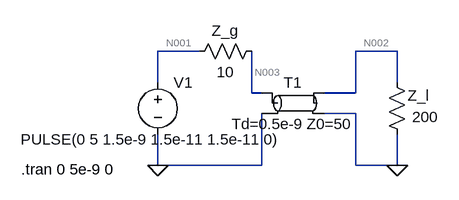
[diagram p0: schematic Problem 5.asc]
Problem 5.asc, the LTspice schematic file:
Version 4
SHEET 1 964 680
WIRE 128 -32 64 -32
WIRE 432 -32 368 -32
WIRE 64 16 64 -32
WIRE 432 16 432 -32
WIRE 208 32 208 -32
WIRE 224 32 208 32
WIRE 368 32 368 -32
WIRE 368 32 320 32
WIRE 368 64 320 64
WIRE 64 144 64 96
WIRE 224 144 224 64
WIRE 224 144 64 144
WIRE 368 144 368 64
WIRE 432 144 432 96
WIRE 432 144 368 144
FLAG 64 144 0
FLAG 432 144 0
SYMBOL voltage 64 0 R0
WINDOW 3 -211 104 Left 2
WINDOW 123 0 0 Left 0
WINDOW 39 0 0 Left 0
SYMATTR InstName V1
SYMATTR Value PULSE(0 5 1.5e-9 1.5e-11 1.5e-11 0)
SYMBOL res 416 0 R0
WINDOW 0 32 36 Left 2
WINDOW 3 39 69 Left 2
SYMATTR InstName Z_l
SYMATTR Value 200
SYMBOL res 224 -48 R90
WINDOW 0 0 56 VBottom 2
WINDOW 3 32 56 VTop 2
SYMATTR InstName Z_g
SYMATTR Value 10
SYMBOL tline 272 48 R0
SYMATTR InstName T1
SYMATTR Value Td=0.5e-9 Z0=50
TEXT -146 150 Left 2 !.tran 0 5e-9 0

The netlist it stands for:
* Problem 5.asc
V1 N001 0 PULSE(0 5 1.5e-9 1.5e-11 1.5e-11 0)
R§Z_l N002 0 200
R§Z_g N003 N001 10
T1 N003 0 N002 0 Td=0.5e-9 Z0=50
.tran 0 5e-9 0
.backanno
.end

* Results of the author's LTspice run, read from the files saved beside the schematic
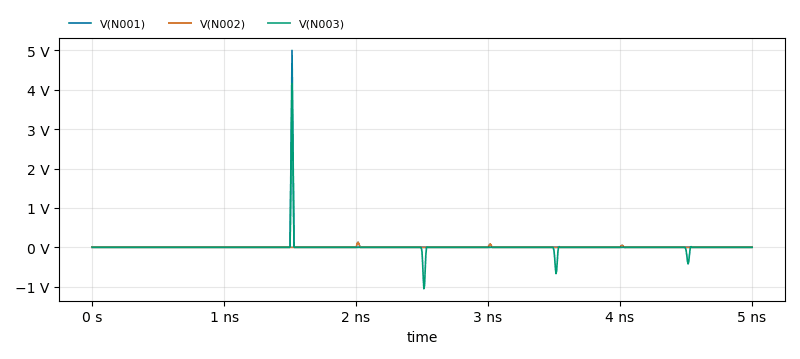
[diagram p1: Transient Analysis of Problem 5.asc, plotted from the saved traces]
* Transient Analysis, 1 run:
*   V(N001): min 0 V, max 5 V, average 15 mV, rms 273.9 mV, last 0 V
*   V(N002): min -1.977 mV, max 132.2 mV, average 1.008 mV, rms 8.608 mV, last 3.135 mV
*   V(N003): min -1.053 V, max 4.167 V, average 4.295 mV, rms 238.7 mV, last 0 V